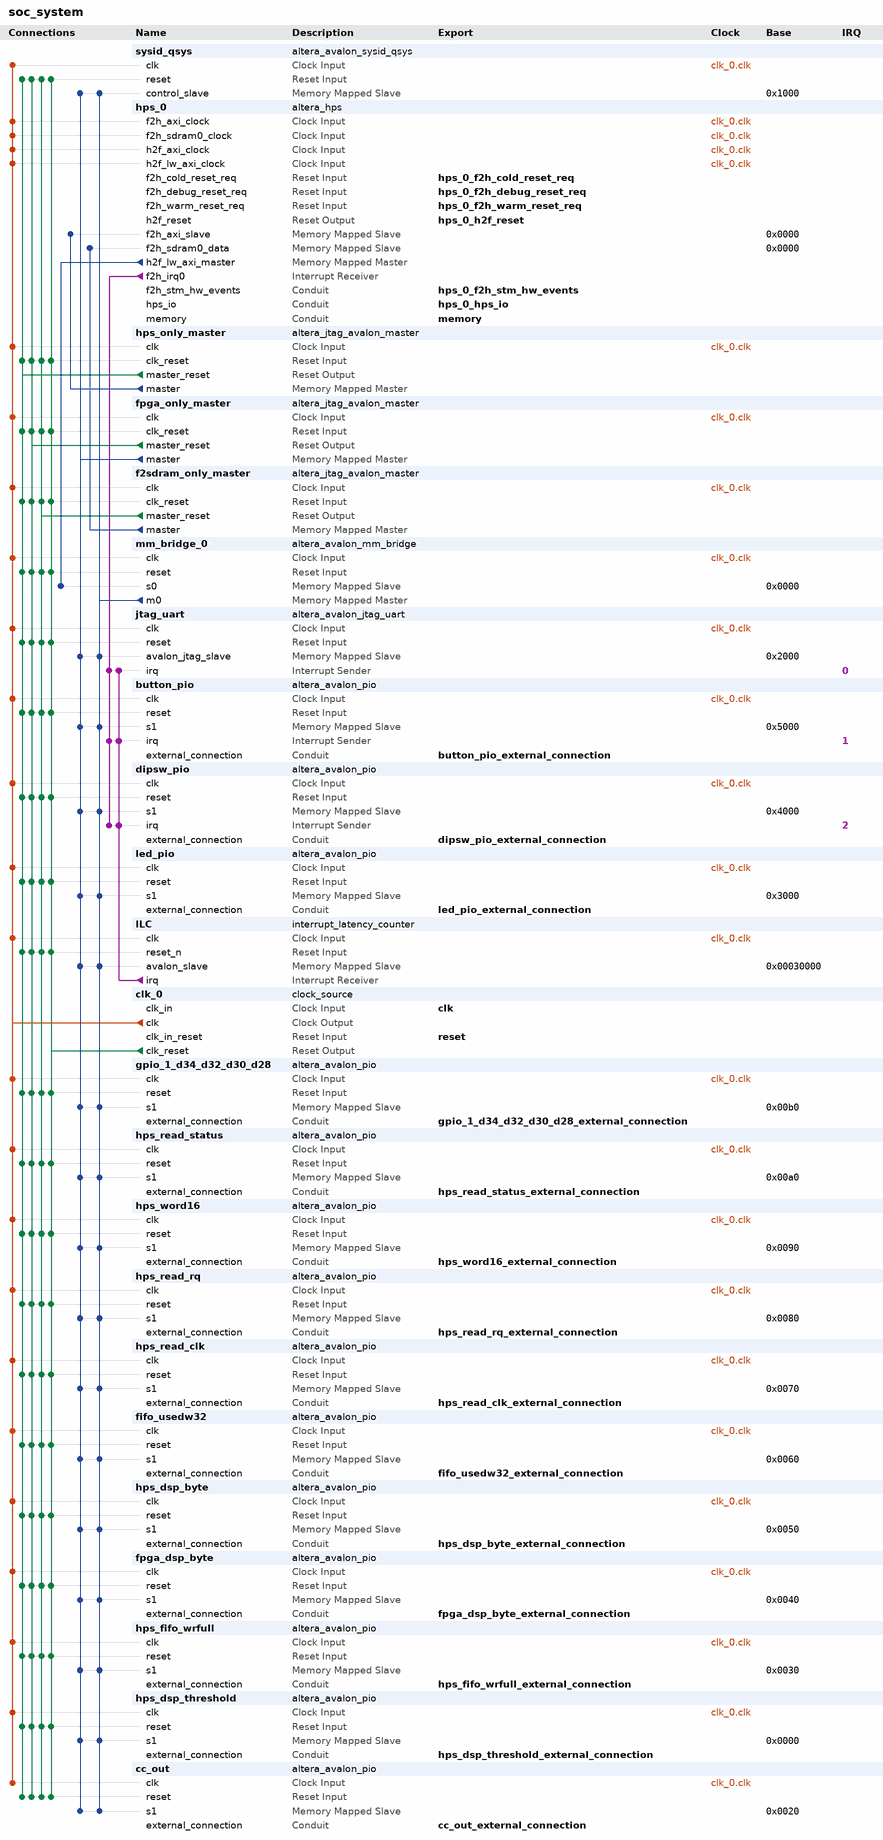
[diagram p0: system contents]
# Platform Designer (Qsys) system soc_system, Cyclone V 5CSEBA6U23I7
# Parameters at their usual value, and those the tool derives, are not listed.
package require -exact qsys 18.1
create_system soc_system
set_project_property DEVICE_FAMILY {Cyclone V}
set_project_property DEVICE 5CSEBA6U23I7

add_instance sysid_qsys altera_avalon_sysid_qsys 18.1
set_instance_parameter_value sysid_qsys id -1395322110

add_instance hps_0 altera_hps 18.1
set_instance_parameter_value hps_0 EMAC1_Mode RGMII
set_instance_parameter_value hps_0 EMAC1_PinMuxing {HPS I/O Set 0}
set_instance_parameter_value hps_0 F2SCLK_COLDRST_Enable true
set_instance_parameter_value hps_0 F2SCLK_DBGRST_Enable true
set_instance_parameter_value hps_0 F2SCLK_WARMRST_Enable true
set_instance_parameter_value hps_0 F2SDRAM_Type {Avalon-MM Bidirectional}
set_instance_parameter_value hps_0 F2SDRAM_Width 256
set_instance_parameter_value hps_0 F2SINTERRUPT_Enable true
set_instance_parameter_value hps_0 F2S_Width 2
set_instance_parameter_value hps_0 FPGA_PERIPHERAL_OUTPUT_CLOCK_FREQ_EMAC0_GTX_CLK 100
set_instance_parameter_value hps_0 FPGA_PERIPHERAL_OUTPUT_CLOCK_FREQ_EMAC0_MD_CLK 100.0
set_instance_parameter_value hps_0 FPGA_PERIPHERAL_OUTPUT_CLOCK_FREQ_EMAC1_GTX_CLK 100
set_instance_parameter_value hps_0 FPGA_PERIPHERAL_OUTPUT_CLOCK_FREQ_EMAC1_MD_CLK 100.0
set_instance_parameter_value hps_0 HPS_PROTOCOL DDR3
set_instance_parameter_value hps_0 I2C0_Mode I2C
set_instance_parameter_value hps_0 I2C0_PinMuxing {HPS I/O Set 0}
set_instance_parameter_value hps_0 I2C1_Mode I2C
set_instance_parameter_value hps_0 I2C1_PinMuxing {HPS I/O Set 0}
set_instance_parameter_value hps_0 LWH2F_Enable true
set_instance_parameter_value hps_0 MEM_BANKADDR_WIDTH 3
set_instance_parameter_value hps_0 MEM_CLK_FREQ 400.0
set_instance_parameter_value hps_0 MEM_COL_ADDR_WIDTH 10
set_instance_parameter_value hps_0 MEM_DQ_WIDTH 32
set_instance_parameter_value hps_0 MEM_DRV_STR RZQ/6
set_instance_parameter_value hps_0 MEM_ROW_ADDR_WIDTH 15
set_instance_parameter_value hps_0 MEM_RTT_NOM RZQ/6
set_instance_parameter_value hps_0 MEM_RTT_WR {Dynamic ODT off}
set_instance_parameter_value hps_0 MEM_TCL 7
set_instance_parameter_value hps_0 MEM_TFAW_NS 37.5
set_instance_parameter_value hps_0 MEM_TRAS_NS 35.0
set_instance_parameter_value hps_0 MEM_TRCD_NS 13.75
set_instance_parameter_value hps_0 MEM_TRFC_NS 300.0
set_instance_parameter_value hps_0 MEM_TRP_NS 13.75
set_instance_parameter_value hps_0 MEM_VENDOR Other
set_instance_parameter_value hps_0 MEM_WTCL 7
set_instance_parameter_value hps_0 QSPI_Mode N/A
set_instance_parameter_value hps_0 QSPI_PinMuxing Unused
set_instance_parameter_value hps_0 REF_CLK_FREQ 25.0
set_instance_parameter_value hps_0 S2FCLK_USER2CLK 4
set_instance_parameter_value hps_0 S2F_Width 2
set_instance_parameter_value hps_0 SDIO_Mode {4-bit Data}
set_instance_parameter_value hps_0 SDIO_PinMuxing {HPS I/O Set 0}
set_instance_parameter_value hps_0 SPIM1_Mode {Single Slave Select}
set_instance_parameter_value hps_0 SPIM1_PinMuxing {HPS I/O Set 0}
set_instance_parameter_value hps_0 STM_Enable true
set_instance_parameter_value hps_0 TIMING_BOARD_AC_SKEW 0.02
set_instance_parameter_value hps_0 TIMING_BOARD_AC_TO_CK_SKEW 0.0
set_instance_parameter_value hps_0 TIMING_BOARD_DQ_TO_DQS_SKEW 0.0
set_instance_parameter_value hps_0 TIMING_BOARD_MAX_CK_DELAY 0.6
set_instance_parameter_value hps_0 TIMING_BOARD_MAX_DQS_DELAY 0.6
set_instance_parameter_value hps_0 TIMING_BOARD_SKEW_BETWEEN_DQS 0.02
set_instance_parameter_value hps_0 TIMING_BOARD_SKEW_CKDQS_DIMM_MAX 0.01
set_instance_parameter_value hps_0 TIMING_BOARD_SKEW_CKDQS_DIMM_MIN -0.01
set_instance_parameter_value hps_0 TIMING_BOARD_SKEW_WITHIN_DQS 0.02
set_instance_parameter_value hps_0 TIMING_TDH 125
set_instance_parameter_value hps_0 TIMING_TDQSCK 400
set_instance_parameter_value hps_0 TIMING_TDQSQ 120
set_instance_parameter_value hps_0 TIMING_TDS 50
set_instance_parameter_value hps_0 TIMING_TIH 250
set_instance_parameter_value hps_0 TIMING_TIS 175
set_instance_parameter_value hps_0 TIMING_TQSH 0.38
set_instance_parameter_value hps_0 UART0_Mode {No Flow Control}
set_instance_parameter_value hps_0 UART0_PinMuxing {HPS I/O Set 0}
set_instance_parameter_value hps_0 USB1_Mode SDR
set_instance_parameter_value hps_0 USB1_PinMuxing {HPS I/O Set 0}
set_instance_parameter_value hps_0 desired_cfg_clk_mhz 100.0
set_instance_parameter_value hps_0 desired_qspi_clk_mhz 370.0

add_instance hps_only_master altera_jtag_avalon_master 18.1

add_instance fpga_only_master altera_jtag_avalon_master 18.1

add_instance f2sdram_only_master altera_jtag_avalon_master 18.1

add_instance mm_bridge_0 altera_avalon_mm_bridge 18.1
set_instance_parameter_value mm_bridge_0 ADDRESS_UNITS SYMBOLS
set_instance_parameter_value mm_bridge_0 ADDRESS_WIDTH 10
set_instance_parameter_value mm_bridge_0 DATA_WIDTH 32
set_instance_parameter_value mm_bridge_0 MAX_PENDING_RESPONSES 4
set_instance_parameter_value mm_bridge_0 USE_AUTO_ADDRESS_WIDTH 1

add_instance jtag_uart altera_avalon_jtag_uart 18.1
set_instance_parameter_value jtag_uart allowMultipleConnections true
set_instance_parameter_value jtag_uart simInteractiveOptions INTERACTIVE_ASCII_OUTPUT

add_instance button_pio altera_avalon_pio 18.1
set_instance_parameter_value button_pio bitClearingEdgeCapReg true
set_instance_parameter_value button_pio captureEdge true
set_instance_parameter_value button_pio direction Input
set_instance_parameter_value button_pio edgeType FALLING
set_instance_parameter_value button_pio generateIRQ true
set_instance_parameter_value button_pio irqType EDGE
set_instance_parameter_value button_pio width 2

add_instance dipsw_pio altera_avalon_pio 18.1
set_instance_parameter_value dipsw_pio bitClearingEdgeCapReg true
set_instance_parameter_value dipsw_pio captureEdge true
set_instance_parameter_value dipsw_pio direction Input
set_instance_parameter_value dipsw_pio edgeType ANY
set_instance_parameter_value dipsw_pio generateIRQ true
set_instance_parameter_value dipsw_pio irqType EDGE
set_instance_parameter_value dipsw_pio width 4

add_instance led_pio altera_avalon_pio 18.1
set_instance_parameter_value led_pio direction Output
set_instance_parameter_value led_pio resetValue 127
set_instance_parameter_value led_pio width 7

add_instance ILC interrupt_latency_counter 18.1
set_instance_parameter_value ILC IRQ_PORT_CNT 4

add_instance clk_0 clock_source 18.1
set_instance_parameter_value clk_0 clockFrequency 50000000

add_instance gpio_1_d34_d32_d30_d28 altera_avalon_pio 18.1
set_instance_parameter_value gpio_1_d34_d32_d30_d28 captureEdge true
set_instance_parameter_value gpio_1_d34_d32_d30_d28 direction Input
set_instance_parameter_value gpio_1_d34_d32_d30_d28 edgeType ANY
set_instance_parameter_value gpio_1_d34_d32_d30_d28 irqType EDGE
set_instance_parameter_value gpio_1_d34_d32_d30_d28 width 4

add_instance hps_read_status altera_avalon_pio 18.1
set_instance_parameter_value hps_read_status captureEdge true
set_instance_parameter_value hps_read_status direction Input
set_instance_parameter_value hps_read_status edgeType ANY
set_instance_parameter_value hps_read_status irqType EDGE
set_instance_parameter_value hps_read_status width 8

add_instance hps_word16 altera_avalon_pio 18.1
set_instance_parameter_value hps_word16 captureEdge true
set_instance_parameter_value hps_word16 direction Input
set_instance_parameter_value hps_word16 edgeType ANY
set_instance_parameter_value hps_word16 irqType EDGE
set_instance_parameter_value hps_word16 width 16

add_instance hps_read_rq altera_avalon_pio 18.1
set_instance_parameter_value hps_read_rq direction Output
set_instance_parameter_value hps_read_rq width 8

add_instance hps_read_clk altera_avalon_pio 18.1
set_instance_parameter_value hps_read_clk direction Output
set_instance_parameter_value hps_read_clk width 8

add_instance fifo_usedw32 altera_avalon_pio 18.1
set_instance_parameter_value fifo_usedw32 captureEdge true
set_instance_parameter_value fifo_usedw32 direction Input
set_instance_parameter_value fifo_usedw32 edgeType ANY
set_instance_parameter_value fifo_usedw32 width 32

add_instance hps_dsp_byte altera_avalon_pio 18.1
set_instance_parameter_value hps_dsp_byte direction Output
set_instance_parameter_value hps_dsp_byte width 8

add_instance fpga_dsp_byte altera_avalon_pio 18.1
set_instance_parameter_value fpga_dsp_byte captureEdge true
set_instance_parameter_value fpga_dsp_byte direction Input
set_instance_parameter_value fpga_dsp_byte width 8

add_instance hps_fifo_wrfull altera_avalon_pio 18.1
set_instance_parameter_value hps_fifo_wrfull captureEdge true
set_instance_parameter_value hps_fifo_wrfull direction Input
set_instance_parameter_value hps_fifo_wrfull edgeType ANY
set_instance_parameter_value hps_fifo_wrfull irqType EDGE
set_instance_parameter_value hps_fifo_wrfull width 8

add_instance hps_dsp_threshold altera_avalon_pio 18.1
set_instance_parameter_value hps_dsp_threshold bitClearingEdgeCapReg true
set_instance_parameter_value hps_dsp_threshold bitModifyingOutReg true
set_instance_parameter_value hps_dsp_threshold captureEdge true
set_instance_parameter_value hps_dsp_threshold direction Output
set_instance_parameter_value hps_dsp_threshold width 32

add_instance cc_out altera_avalon_pio 18.1
set_instance_parameter_value cc_out captureEdge true
set_instance_parameter_value cc_out direction Input
set_instance_parameter_value cc_out edgeType ANY
set_instance_parameter_value cc_out width 32

# connections
add_connection clk_0.clk button_pio.clk clock
add_connection clk_0.clk cc_out.clk clock
add_connection clk_0.clk dipsw_pio.clk clock
add_connection clk_0.clk f2sdram_only_master.clk clock
add_connection clk_0.clk fifo_usedw32.clk clock
add_connection clk_0.clk fpga_dsp_byte.clk clock
add_connection clk_0.clk fpga_only_master.clk clock
add_connection clk_0.clk gpio_1_d34_d32_d30_d28.clk clock
add_connection clk_0.clk hps_0.f2h_axi_clock clock
add_connection clk_0.clk hps_0.f2h_sdram0_clock clock
add_connection clk_0.clk hps_0.h2f_axi_clock clock
add_connection clk_0.clk hps_0.h2f_lw_axi_clock clock
add_connection clk_0.clk hps_dsp_byte.clk clock
add_connection clk_0.clk hps_dsp_threshold.clk clock
add_connection clk_0.clk hps_fifo_wrfull.clk clock
add_connection clk_0.clk hps_only_master.clk clock
add_connection clk_0.clk hps_read_clk.clk clock
add_connection clk_0.clk hps_read_rq.clk clock
add_connection clk_0.clk hps_read_status.clk clock
add_connection clk_0.clk hps_word16.clk clock
add_connection clk_0.clk ILC.clk clock
add_connection clk_0.clk jtag_uart.clk clock
add_connection clk_0.clk led_pio.clk clock
add_connection clk_0.clk mm_bridge_0.clk clock
add_connection clk_0.clk sysid_qsys.clk clock
add_connection clk_0.clk_reset button_pio.reset reset
add_connection clk_0.clk_reset cc_out.reset reset
add_connection clk_0.clk_reset dipsw_pio.reset reset
add_connection clk_0.clk_reset f2sdram_only_master.clk_reset reset
add_connection clk_0.clk_reset fifo_usedw32.reset reset
add_connection clk_0.clk_reset fpga_dsp_byte.reset reset
add_connection clk_0.clk_reset fpga_only_master.clk_reset reset
add_connection clk_0.clk_reset gpio_1_d34_d32_d30_d28.reset reset
add_connection clk_0.clk_reset hps_dsp_byte.reset reset
add_connection clk_0.clk_reset hps_dsp_threshold.reset reset
add_connection clk_0.clk_reset hps_fifo_wrfull.reset reset
add_connection clk_0.clk_reset hps_only_master.clk_reset reset
add_connection clk_0.clk_reset hps_read_clk.reset reset
add_connection clk_0.clk_reset hps_read_rq.reset reset
add_connection clk_0.clk_reset hps_read_status.reset reset
add_connection clk_0.clk_reset hps_word16.reset reset
add_connection clk_0.clk_reset ILC.reset_n reset
add_connection clk_0.clk_reset jtag_uart.reset reset
add_connection clk_0.clk_reset led_pio.reset reset
add_connection clk_0.clk_reset mm_bridge_0.reset reset
add_connection clk_0.clk_reset sysid_qsys.reset reset
add_connection f2sdram_only_master.master_reset button_pio.reset reset
add_connection f2sdram_only_master.master_reset cc_out.reset reset
add_connection f2sdram_only_master.master_reset dipsw_pio.reset reset
add_connection f2sdram_only_master.master_reset f2sdram_only_master.clk_reset reset
add_connection f2sdram_only_master.master_reset fifo_usedw32.reset reset
add_connection f2sdram_only_master.master_reset fpga_dsp_byte.reset reset
add_connection f2sdram_only_master.master_reset fpga_only_master.clk_reset reset
add_connection f2sdram_only_master.master_reset gpio_1_d34_d32_d30_d28.reset reset
add_connection f2sdram_only_master.master_reset hps_dsp_byte.reset reset
add_connection f2sdram_only_master.master_reset hps_dsp_threshold.reset reset
add_connection f2sdram_only_master.master_reset hps_fifo_wrfull.reset reset
add_connection f2sdram_only_master.master_reset hps_only_master.clk_reset reset
add_connection f2sdram_only_master.master_reset hps_read_clk.reset reset
add_connection f2sdram_only_master.master_reset hps_read_rq.reset reset
add_connection f2sdram_only_master.master_reset hps_read_status.reset reset
add_connection f2sdram_only_master.master_reset hps_word16.reset reset
add_connection f2sdram_only_master.master_reset ILC.reset_n reset
add_connection f2sdram_only_master.master_reset jtag_uart.reset reset
add_connection f2sdram_only_master.master_reset led_pio.reset reset
add_connection f2sdram_only_master.master_reset mm_bridge_0.reset reset
add_connection f2sdram_only_master.master_reset sysid_qsys.reset reset
add_connection fpga_only_master.master_reset button_pio.reset reset
add_connection fpga_only_master.master_reset cc_out.reset reset
add_connection fpga_only_master.master_reset dipsw_pio.reset reset
add_connection fpga_only_master.master_reset f2sdram_only_master.clk_reset reset
add_connection fpga_only_master.master_reset fifo_usedw32.reset reset
add_connection fpga_only_master.master_reset fpga_dsp_byte.reset reset
add_connection fpga_only_master.master_reset fpga_only_master.clk_reset reset
add_connection fpga_only_master.master_reset gpio_1_d34_d32_d30_d28.reset reset
add_connection fpga_only_master.master_reset hps_dsp_byte.reset reset
add_connection fpga_only_master.master_reset hps_dsp_threshold.reset reset
add_connection fpga_only_master.master_reset hps_fifo_wrfull.reset reset
add_connection fpga_only_master.master_reset hps_only_master.clk_reset reset
add_connection fpga_only_master.master_reset hps_read_clk.reset reset
add_connection fpga_only_master.master_reset hps_read_rq.reset reset
add_connection fpga_only_master.master_reset hps_read_status.reset reset
add_connection fpga_only_master.master_reset hps_word16.reset reset
add_connection fpga_only_master.master_reset ILC.reset_n reset
add_connection fpga_only_master.master_reset jtag_uart.reset reset
add_connection fpga_only_master.master_reset led_pio.reset reset
add_connection fpga_only_master.master_reset mm_bridge_0.reset reset
add_connection fpga_only_master.master_reset sysid_qsys.reset reset
add_connection hps_only_master.master_reset button_pio.reset reset
add_connection hps_only_master.master_reset cc_out.reset reset
add_connection hps_only_master.master_reset dipsw_pio.reset reset
add_connection hps_only_master.master_reset f2sdram_only_master.clk_reset reset
add_connection hps_only_master.master_reset fifo_usedw32.reset reset
add_connection hps_only_master.master_reset fpga_dsp_byte.reset reset
add_connection hps_only_master.master_reset fpga_only_master.clk_reset reset
add_connection hps_only_master.master_reset gpio_1_d34_d32_d30_d28.reset reset
add_connection hps_only_master.master_reset hps_dsp_byte.reset reset
add_connection hps_only_master.master_reset hps_dsp_threshold.reset reset
add_connection hps_only_master.master_reset hps_fifo_wrfull.reset reset
add_connection hps_only_master.master_reset hps_only_master.clk_reset reset
add_connection hps_only_master.master_reset hps_read_clk.reset reset
add_connection hps_only_master.master_reset hps_read_rq.reset reset
add_connection hps_only_master.master_reset hps_read_status.reset reset
add_connection hps_only_master.master_reset hps_word16.reset reset
add_connection hps_only_master.master_reset ILC.reset_n reset
add_connection hps_only_master.master_reset jtag_uart.reset reset
add_connection hps_only_master.master_reset led_pio.reset reset
add_connection hps_only_master.master_reset mm_bridge_0.reset reset
add_connection hps_only_master.master_reset sysid_qsys.reset reset
add_connection f2sdram_only_master.master hps_0.f2h_sdram0_data avalon
set_connection_parameter_value f2sdram_only_master.master/hps_0.f2h_sdram0_data baseAddress 0x0000
add_connection fpga_only_master.master button_pio.s1 avalon
set_connection_parameter_value fpga_only_master.master/button_pio.s1 baseAddress 0x5000
add_connection fpga_only_master.master cc_out.s1 avalon
set_connection_parameter_value fpga_only_master.master/cc_out.s1 baseAddress 0x0020
add_connection fpga_only_master.master dipsw_pio.s1 avalon
set_connection_parameter_value fpga_only_master.master/dipsw_pio.s1 baseAddress 0x4000
add_connection fpga_only_master.master fifo_usedw32.s1 avalon
set_connection_parameter_value fpga_only_master.master/fifo_usedw32.s1 baseAddress 0x0060
add_connection fpga_only_master.master fpga_dsp_byte.s1 avalon
set_connection_parameter_value fpga_only_master.master/fpga_dsp_byte.s1 baseAddress 0x0040
add_connection fpga_only_master.master gpio_1_d34_d32_d30_d28.s1 avalon
set_connection_parameter_value fpga_only_master.master/gpio_1_d34_d32_d30_d28.s1 baseAddress 0x00b0
add_connection fpga_only_master.master hps_dsp_byte.s1 avalon
set_connection_parameter_value fpga_only_master.master/hps_dsp_byte.s1 baseAddress 0x0050
add_connection fpga_only_master.master hps_dsp_threshold.s1 avalon
set_connection_parameter_value fpga_only_master.master/hps_dsp_threshold.s1 baseAddress 0x0000
add_connection fpga_only_master.master hps_fifo_wrfull.s1 avalon
set_connection_parameter_value fpga_only_master.master/hps_fifo_wrfull.s1 baseAddress 0x0030
add_connection fpga_only_master.master hps_read_clk.s1 avalon
set_connection_parameter_value fpga_only_master.master/hps_read_clk.s1 baseAddress 0x0070
add_connection fpga_only_master.master hps_read_rq.s1 avalon
set_connection_parameter_value fpga_only_master.master/hps_read_rq.s1 baseAddress 0x0080
add_connection fpga_only_master.master hps_read_status.s1 avalon
set_connection_parameter_value fpga_only_master.master/hps_read_status.s1 baseAddress 0x00a0
add_connection fpga_only_master.master hps_word16.s1 avalon
set_connection_parameter_value fpga_only_master.master/hps_word16.s1 baseAddress 0x0090
add_connection fpga_only_master.master ILC.avalon_slave avalon
set_connection_parameter_value fpga_only_master.master/ILC.avalon_slave baseAddress 0x00030000
add_connection fpga_only_master.master jtag_uart.avalon_jtag_slave avalon
set_connection_parameter_value fpga_only_master.master/jtag_uart.avalon_jtag_slave baseAddress 0x2000
add_connection fpga_only_master.master led_pio.s1 avalon
set_connection_parameter_value fpga_only_master.master/led_pio.s1 baseAddress 0x3000
add_connection fpga_only_master.master sysid_qsys.control_slave avalon
set_connection_parameter_value fpga_only_master.master/sysid_qsys.control_slave baseAddress 0x1000
add_connection hps_0.h2f_lw_axi_master mm_bridge_0.s0 avalon
set_connection_parameter_value hps_0.h2f_lw_axi_master/mm_bridge_0.s0 baseAddress 0x0000
add_connection hps_only_master.master hps_0.f2h_axi_slave avalon
set_connection_parameter_value hps_only_master.master/hps_0.f2h_axi_slave baseAddress 0x0000
add_connection mm_bridge_0.m0 button_pio.s1 avalon
set_connection_parameter_value mm_bridge_0.m0/button_pio.s1 baseAddress 0x5000
add_connection mm_bridge_0.m0 cc_out.s1 avalon
set_connection_parameter_value mm_bridge_0.m0/cc_out.s1 baseAddress 0x0020
add_connection mm_bridge_0.m0 dipsw_pio.s1 avalon
set_connection_parameter_value mm_bridge_0.m0/dipsw_pio.s1 baseAddress 0x4000
add_connection mm_bridge_0.m0 fifo_usedw32.s1 avalon
set_connection_parameter_value mm_bridge_0.m0/fifo_usedw32.s1 baseAddress 0x0060
add_connection mm_bridge_0.m0 fpga_dsp_byte.s1 avalon
set_connection_parameter_value mm_bridge_0.m0/fpga_dsp_byte.s1 baseAddress 0x0040
add_connection mm_bridge_0.m0 gpio_1_d34_d32_d30_d28.s1 avalon
set_connection_parameter_value mm_bridge_0.m0/gpio_1_d34_d32_d30_d28.s1 baseAddress 0x00b0
add_connection mm_bridge_0.m0 hps_dsp_byte.s1 avalon
set_connection_parameter_value mm_bridge_0.m0/hps_dsp_byte.s1 baseAddress 0x0050
add_connection mm_bridge_0.m0 hps_dsp_threshold.s1 avalon
set_connection_parameter_value mm_bridge_0.m0/hps_dsp_threshold.s1 baseAddress 0x0000
add_connection mm_bridge_0.m0 hps_fifo_wrfull.s1 avalon
set_connection_parameter_value mm_bridge_0.m0/hps_fifo_wrfull.s1 baseAddress 0x0030
add_connection mm_bridge_0.m0 hps_read_clk.s1 avalon
set_connection_parameter_value mm_bridge_0.m0/hps_read_clk.s1 baseAddress 0x0070
add_connection mm_bridge_0.m0 hps_read_rq.s1 avalon
set_connection_parameter_value mm_bridge_0.m0/hps_read_rq.s1 baseAddress 0x0080
add_connection mm_bridge_0.m0 hps_read_status.s1 avalon
set_connection_parameter_value mm_bridge_0.m0/hps_read_status.s1 baseAddress 0x00a0
add_connection mm_bridge_0.m0 hps_word16.s1 avalon
set_connection_parameter_value mm_bridge_0.m0/hps_word16.s1 baseAddress 0x0090
add_connection mm_bridge_0.m0 ILC.avalon_slave avalon
set_connection_parameter_value mm_bridge_0.m0/ILC.avalon_slave baseAddress 0x00030000
add_connection mm_bridge_0.m0 jtag_uart.avalon_jtag_slave avalon
set_connection_parameter_value mm_bridge_0.m0/jtag_uart.avalon_jtag_slave baseAddress 0x2000
add_connection mm_bridge_0.m0 led_pio.s1 avalon
set_connection_parameter_value mm_bridge_0.m0/led_pio.s1 baseAddress 0x3000
add_connection mm_bridge_0.m0 sysid_qsys.control_slave avalon
set_connection_parameter_value mm_bridge_0.m0/sysid_qsys.control_slave baseAddress 0x1000
add_connection hps_0.f2h_irq0 button_pio.irq interrupt
set_connection_parameter_value hps_0.f2h_irq0/button_pio.irq irqNumber 1
add_connection hps_0.f2h_irq0 dipsw_pio.irq interrupt
set_connection_parameter_value hps_0.f2h_irq0/dipsw_pio.irq irqNumber 2
add_connection hps_0.f2h_irq0 jtag_uart.irq interrupt
set_connection_parameter_value hps_0.f2h_irq0/jtag_uart.irq irqNumber 0
add_connection ILC.irq button_pio.irq interrupt
set_connection_parameter_value ILC.irq/button_pio.irq irqNumber 1
add_connection ILC.irq dipsw_pio.irq interrupt
set_connection_parameter_value ILC.irq/dipsw_pio.irq irqNumber 2
add_connection ILC.irq jtag_uart.irq interrupt
set_connection_parameter_value ILC.irq/jtag_uart.irq irqNumber 0

# exported interfaces
add_interface button_pio_external_connection conduit end
set_interface_property button_pio_external_connection EXPORT_OF button_pio.external_connection
add_interface cc_out_external_connection conduit end
set_interface_property cc_out_external_connection EXPORT_OF cc_out.external_connection
add_interface clk clock sink
set_interface_property clk EXPORT_OF clk_0.clk_in
add_interface dipsw_pio_external_connection conduit end
set_interface_property dipsw_pio_external_connection EXPORT_OF dipsw_pio.external_connection
add_interface fifo_usedw32_external_connection conduit end
set_interface_property fifo_usedw32_external_connection EXPORT_OF fifo_usedw32.external_connection
add_interface fpga_dsp_byte_external_connection conduit end
set_interface_property fpga_dsp_byte_external_connection EXPORT_OF fpga_dsp_byte.external_connection
add_interface gpio_1_d34_d32_d30_d28_external_connection conduit end
set_interface_property gpio_1_d34_d32_d30_d28_external_connection EXPORT_OF gpio_1_d34_d32_d30_d28.external_connection
add_interface hps_0_f2h_cold_reset_req reset sink
set_interface_property hps_0_f2h_cold_reset_req EXPORT_OF hps_0.f2h_cold_reset_req
add_interface hps_0_f2h_debug_reset_req reset sink
set_interface_property hps_0_f2h_debug_reset_req EXPORT_OF hps_0.f2h_debug_reset_req
add_interface hps_0_f2h_stm_hw_events conduit end
set_interface_property hps_0_f2h_stm_hw_events EXPORT_OF hps_0.f2h_stm_hw_events
add_interface hps_0_f2h_warm_reset_req reset sink
set_interface_property hps_0_f2h_warm_reset_req EXPORT_OF hps_0.f2h_warm_reset_req
add_interface hps_0_h2f_reset reset source
set_interface_property hps_0_h2f_reset EXPORT_OF hps_0.h2f_reset
add_interface hps_0_hps_io conduit end
set_interface_property hps_0_hps_io EXPORT_OF hps_0.hps_io
add_interface hps_dsp_byte_external_connection conduit end
set_interface_property hps_dsp_byte_external_connection EXPORT_OF hps_dsp_byte.external_connection
add_interface hps_dsp_threshold_external_connection conduit end
set_interface_property hps_dsp_threshold_external_connection EXPORT_OF hps_dsp_threshold.external_connection
add_interface hps_fifo_wrfull_external_connection conduit end
set_interface_property hps_fifo_wrfull_external_connection EXPORT_OF hps_fifo_wrfull.external_connection
add_interface hps_read_clk_external_connection conduit end
set_interface_property hps_read_clk_external_connection EXPORT_OF hps_read_clk.external_connection
add_interface hps_read_rq_external_connection conduit end
set_interface_property hps_read_rq_external_connection EXPORT_OF hps_read_rq.external_connection
add_interface hps_read_status_external_connection conduit end
set_interface_property hps_read_status_external_connection EXPORT_OF hps_read_status.external_connection
add_interface hps_word16_external_connection conduit end
set_interface_property hps_word16_external_connection EXPORT_OF hps_word16.external_connection
add_interface led_pio_external_connection conduit end
set_interface_property led_pio_external_connection EXPORT_OF led_pio.external_connection
add_interface memory conduit end
set_interface_property memory EXPORT_OF hps_0.memory
add_interface reset reset sink
set_interface_property reset EXPORT_OF clk_0.clk_in_reset

set_interconnect_requirement {$system} qsys_mm.clockCrossingAdapter HANDSHAKE
set_interconnect_requirement {$system} qsys_mm.maxAdditionalLatency 1

save_system soc_system.qsys
